# Altium schematic sheet Main.SchDoc
size A4; SheetNumber: 1; SheetTotal: 3
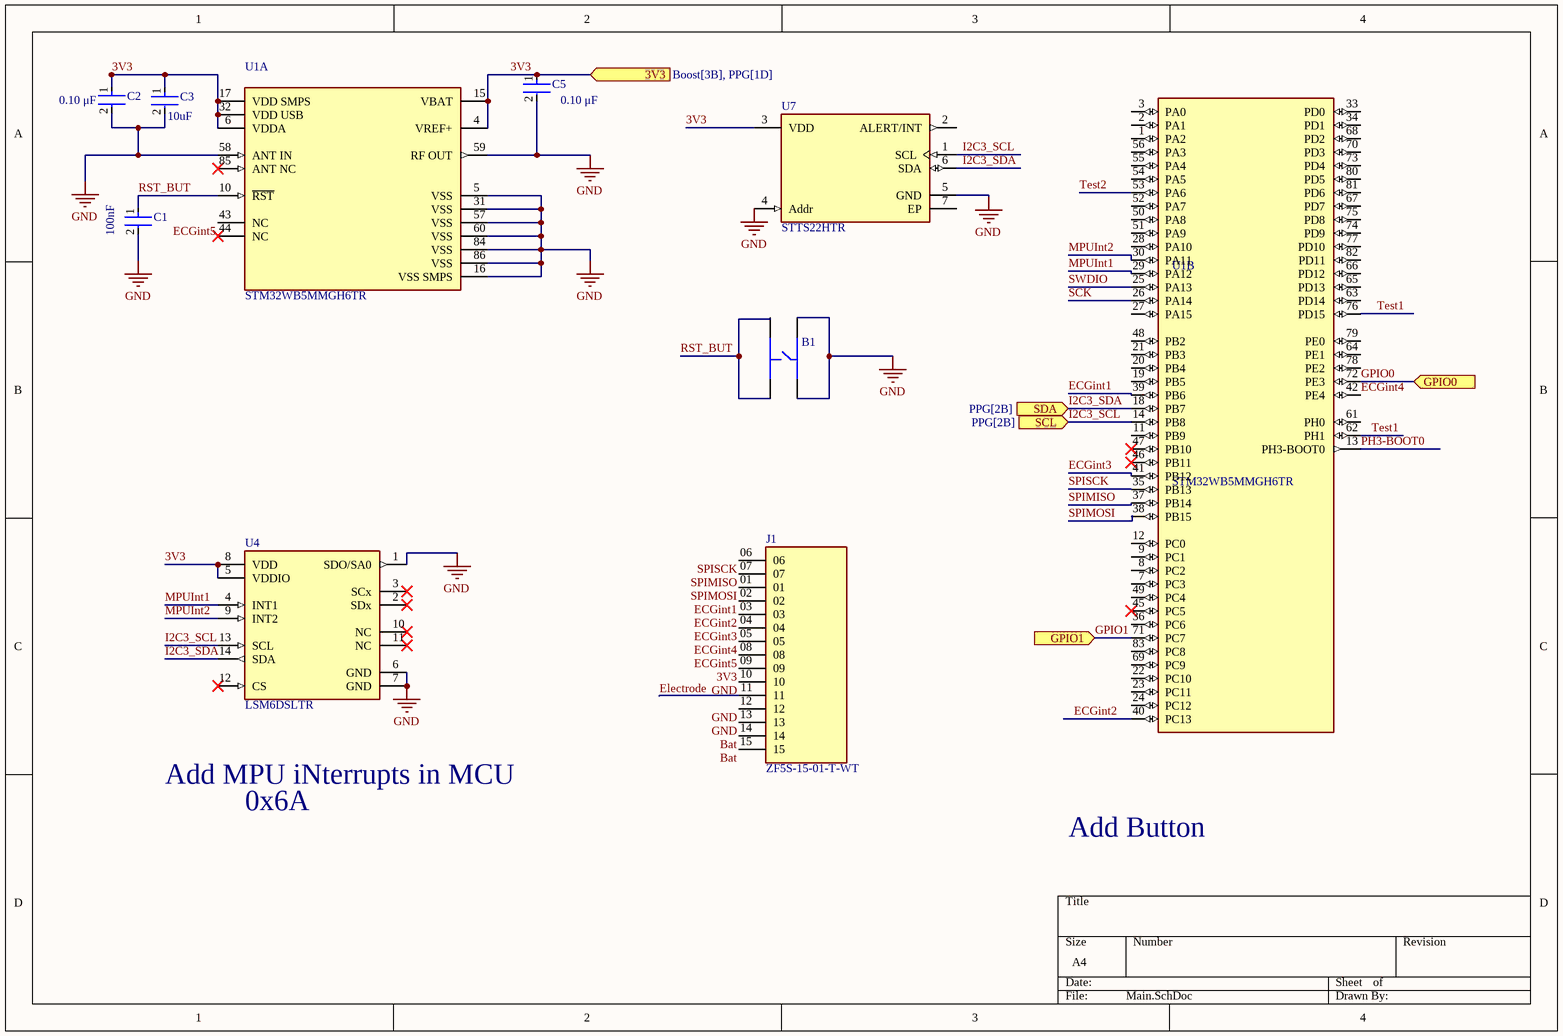
[diagram p0: Main.SchDoc]

## Parts
B1  TS3425PA  [TS3425PA]  (value not drawn)
C1  value 100nF  [FP-GRM155-0_05-MFG]  (hidden comment: GRM155R71C104KA88J)
C2  Capacitance: 0.10 μF  [FP-C0402-BB-MFG]  (hidden comment: C0402C104K3RACTU)
C3  Capacitance: 10uF  [FP-CL10-IPC_A]  (hidden comment: CL10A106MA8NRNC)
C5  Capacitance: 0.10 μF  [FP-C0402-BB-MFG]  (hidden comment: C0402C104K3RACTU)
J1  ZF5S-15-01-T-WT  [ZF5S-15-01-T-WT]
U1  STM32WB5MMGH6TR  [STM32WB5MMGH6TR]  (parts A,B of 2)
U4  LSM6DSLTR  [FP-LGA-14L-DM00249496-MFG]
U7  STTS22HTR  [FP-UDFN-6L-DM00423052-MFG]

## Ports
3V3 (in, see Boost[3B], PPG[1D]), GPIO0 (in, see PPG[2C]), GPIO1 (in, see PPG[2C]), SCL (in, see PPG[2B]), SDA (in, see PPG[2B])

## Nets
GND: B1.3 B1.4 C1.2 C2.2 C3.2 C5.2 J1.10 J1.12 J1.13 U1.5(VSS) U1.16(VSS_SMPS) U1.31(VSS) U1.57(VSS) U1.58(ANT_IN) U1.59(RF_OUT) U1.60(VSS) U1.84(VSS) U1.86(VSS) U4.1(SDO/SA0) U4.6(GND) U4.7(GND) U7.4(Addr) U7.5(GND)
3V3: C2.1 C3.1 C5.1 J1.09 U1.4(VREF+) U1.6(VDDA) U1.15(VBAT) U1.17(VDD_SMPS) U1.32(VDD_USB) U4.5(VDDIO) U4.8(VDD) U7.3(VDD) ; port 3V3
Bat: J1.14 J1.15
ECGint1: J1.02 U1.39(PB6)
ECGint2: J1.03 U1.40(PC13)
ECGint3: J1.04 U1.41(PB12)
ECGint4: J1.05 U1.42(PE4)
ECGint5: J1.08 U1.43(NC)
Electrode: J1.11
GPIO0: U1.72(PE3) ; port GPIO0
GPIO1: U1.71(PC7) ; port GPIO1
I2C3_SCL: U1.14(PB8) U4.13(SCL) U7.1(SCL) ; port SCL
I2C3_SDA: U1.18(PB7) U4.14(SDA) U7.6(SDA) ; port SDA
MPUInt1: U1.29(PA12) U4.4(INT1)
MPUInt2: U1.30(PA11) U4.9(INT2)
PH3-BOOT0: U1.13(PH3-BOOT0)
RST_BUT: B1.1 C1.1 U1.10(~{RST})
SCK: U1.26(PA14)
SPIMISO: J1.07 U1.37(PB14)
SPIMOSI: J1.01
SPISCK: J1.06 U1.35(PB13)
SWDIO: U1.25(PA13)
Test1: U1.62(PH1) U1.76(PD15)
Test2: U1.53(PA6)

Not connected (* = marked no-connect by the designer): B1 2; U1 1(PA2) 2(PA1) 3(PA0) 7(PC3) 8(PC2) 9(PC1) 11(PB9) 12(PC0) 19(PB5) 20(PB4) 21(PB3) 22(PC10) 23(PC11) 24(PC12) 27(PA15) 28(PA10) 33(PD0) 34(PD1) 36(PC6) 38(PB15) 44(NC)* 45(PC5)* 46(PB11)* 47(PB10)* 48(PB2) 49(PC4) 50(PA8) 51(PA9) 52(PA7) 54(PA5) 55(PA4) 56(PA3) 61(PH0) 63(PD14) 64(PE1) 65(PD13) 66(PD12) 67(PD7) 68(PD2) 69(PC9) 70(PD3) 73(PD4) 74(PD9) 75(PD8) 77(PD10) 78(PE2) 79(PE0) 80(PD5) 81(PD6) 82(PD11) 83(PC8) 85(ANT_NC)*; U4 2(SDx)* 3(SCx)* 10(NC)* 11(NC)* 12(CS)*; U7 2(ALERT/INT) 7(EP)

## Notes on the sheet
- Add MPU iNterrupts in MCU
- 0x6A
- Add Button

## Library data of the parts
C1 = CMP-2008-03928-2: NexarPartId: 9223238; Manufacturer Lifecycle Status: NRND; Manufacturer: Murata; Voltage: 16V; Tolerance: 10%; Dielectric: X7R; Material: Ceramic; Schedule B: 8532240020, 8532240020; Mount: Surface Mount; Case/Package: 0402; Case Code (Imperial): 0402; Min Operating Temperature: -55°C; Length: 1mm; Voltage Rating (DC): 16V; Depth: 500µm; Lead Free: Lead Free; Max Operating Temperature: 125°C; Case Code (Metric): 1005; Radiation Hardening: No; Height: 550µm; Voltage Rating: 16V; Packaging: Cut Tape; RoHS: Compliant; Width: 500µm; Number of Pins: 2; REACH SVHC: No SVHC; Termination: SMD/SMT; Thickness: 500µm; Capacitance: 100nF; Supplier: Digikey; Supplier Part Number: 490-6328-1-ND; Manufacturer Part Number: GRM155R71C104KA88J; Category: Ceramic Capacitors; Stock: 17752595; Pricing: 1=0.08, 10=0.009, 50=0.0072, 100=0.0056, 500=0.0052, 1000=0.0048, 2500=0.004 (USD); Mounting Technology: Surface Mount; Pins: 2NUMBER; Package Quantity: 1; Series: GRM; Construction: Flat; Reach SVHC Compliant: No; RoHS Compliant: Yes; ComponentLink1URL: https://datasheet.ciiva.com/6271/product-6271168.pdf?src-supplier=Digikey; ComponentLink1Description: https://datasheet.ciiva.com/6271/product-6271168.pdf?src-supplier=Digikey; ComponentLink2URL: https://datasheet.ciiva.com/6271/grm155r71c104ka88-01-6271231.pdf?src-supplier=Digikey; ComponentLink2Description: https://datasheet.ciiva.com/6271/grm155r71c104ka88-01-6271231.pdf?src-supplier=Digikey
C2 C5 = CMP-03020-012858-1: Cap Ceramic 0.1uF 25V X7R 10% Pad SMD 0402 125C T/R; Manufacturer: Kemet; Value: 0.10 μF; Temperature Coefficient: 15%; Tolerance: 0.1; Dielectric Material: 4241ConductorMaterial; Temperature: -55°C to +125°C; Automotive: No; Height: 0.55mm; Package: C0402-BB; Category: Cap; Temperature Range Low: -55°C; Manufacturer Part Number: C0402C104K3RACTU; Device Class L2: Capacitors; Temperature Characteristic: X7R; Lead Free: Yes; Material: Ceramic; Mouser Description: Cap Ceramic 0.1uF 25V X7R 10% Pad SMD 0402 125C T/R; Temperature Range High: +125°C; Digikey Description: Cap Ceramic 0.1uF 25V X7R 10% Pad SMD 0402 125C T/R; Ipc Land Pattern Name: CAPC10050X50; Voltage Rating: 25 V; ComponentLink2URL: https://content.kemet.com/datasheets/KEM_C1002_X7R_SMD.pdf; Device Class L3: Ceramic Capacitors; RoHS: TRUE; Device Class L1: Passive Components; Octopart: https://octopart.com/c0402c104k3ractu-kemet-71105629; ComponentLink2Description: Datasheet; Supplier: Digikey; Supplier Part Number: 399-14148-1-ND; Stock: 453452; Pricing: 1=0.16, 10=0.095, 100=0.0611, 1000=0.04279, 2500=0.03794, 5000=0.0349 (USD); Case/Package: 0402; Pins: 2NUMBER; Case Code (Metric): 1005; Case Code (Imperial): 0402; Min Operating Temperature: -55°C; Max Operating Temperature: 125°C; Dielectric: X7R; Packaging: Cut Tape; Voltage Rating (DC): 25V; Reach SVHC Compliant: No; RoHS Compliant: Yes; ComponentLink1URL: http://www.farnell.com/datasheets/2746129.pdf?src-supplier=Farnell; ComponentLink1Description: http://www.farnell.com/datasheets/2746129.pdf?src-supplier=Farnell; ComponentLink3URL: http://www.farnell.com/datasheets/2746129.pdf?src-supplier=Newark; ComponentLink3Description: http://www.farnell.com/datasheets/2746129.pdf?src-supplier=Newark; ComponentLink4URL: http://www.farnell.com/datasheets/2746129.pdf?src-supplier=Element14; ComponentLink4Description: http://www.farnell.com/datasheets/2746129.pdf?src-supplier=Element14; ComponentLink5URL: https://datasheet.octopart.com/C0402C104K3RACTU-Kemet-datasheet-62095741.pdf?src-supplier=Element14; ComponentLink5Description: https://datasheet.octopart.com/C0402C104K3RACTU-Kemet-datasheet-62095741.pdf?src-supplier=Element14; ComponentLink6URL: https://api.kemet.com/component-edge/download/datasheet/C0402C104K3RAC7867.pdf?src-supplier=Digikey; ComponentLink6Description: https://api.kemet.com/component-edge/download/datasheet/C0402C104K3RAC7867.pdf?src-supplier=Digikey; ComponentLink7URL: https://datasheet.octopart.com/C0402C104K3RACTU-KEMET-datasheet-176289272.pdf?src-supplier=Newark; ComponentLink7Description: https://datasheet.octopart.com/C0402C104K3RACTU-KEMET-datasheet-176289272.pdf?src-supplier=Newark; ComponentLink8URL: https://datasheet.octopart.com/C0402C104K3RACTU-KEMET-datasheet-157246124.pdf?src-supplier=Electro+Sonic; ComponentLink8Description: https://datasheet.octopart.com/C0402C104K3RACTU-KEMET-datasheet-157246124.pdf?src-supplier=Electro+Sonic
C3 = CMP-13271-004224-1: Cap Ceramic 10uF 25V X5R ±20% Pad SMD 0603 +85°C T/R; Width: 0.031inch; Voltage Rating: 25V; Length: 0.063inch; Case Code (Metric): 1608; Dielectric: X5R; Termination: Wraparound; Lead Free: Lead Free; Mount: Surface Mount; Package Quantity: 1; Case Code (Imperial): 0603; Thickness: 0.035inch; Packaging: Tape and Reel; Contact Plating: Tin; Min Operating Temperature: -55°C; Tolerance: 20%; Max Operating Temperature: 85°C; Case/Package: 0603
J1 = ZF5S-15-01-T-WT: FFC & FPC Connectors Zero Insertion Force Connector for FFC, 0.50 mm (.0197) Pitch; Manufacturer: Samtec; Actuator Material: Polymer,Liquid Crystal Polymer; Actuator Color: Black; Wire/Cable Type: Straight; Number of Positions: 15; Max Current Rating: 1.4A; Pitch: 0.5mm; Supplier: Digikey; Supplier Part Number: SAM10388-ND; Manufacturer Part Number: ZF5S-15-01-T-WT; RoHS: Yes; Category: FFC / FPC; Stock: 265; Pricing: 1=2.37, 50=1.93, 100=1.64, 500=1.46, 1000=1.2763 (USD); Mounting Technology: Surface Mount; Contact Material: Bronze; Contact Plating: Tin; Housing Color: Natural; Housing Material: Polymer; Min Operating Temperature: -55°C; Max Operating Temperature: 105°C; Packaging: Rail/Tube; Termination: Solder; Series: ZF5S; Number of Rows: 1; Number of Contacts: 15; Orientation: Right Angle; Length: 13.15mm; Depth: 5.66mm; Radiation Hardening: No; RoHS Compliant: Yes; ComponentLink1URL: http://www.farnell.com/datasheets/2607237.pdf?src-supplier=Farnell; ComponentLink1Description: http://www.farnell.com/datasheets/2607237.pdf?src-supplier=Farnell; ComponentLink2URL: http://components.arrow.com/part/dataview/51417210S9388675N1004?src-supplier=Arrow+Electronics; ComponentLink2Description: http://components.arrow.com/part/dataview/51417210S9388675N1004?src-supplier=Arrow+Electronics; ComponentLink3URL: http://www.farnell.com/datasheets/2607237.pdf?src-supplier=Newark; ComponentLink3Description: http://www.farnell.com/datasheets/2607237.pdf?src-supplier=Newark; ComponentLink4URL: http://www.samtec.com/documents/webfiles/pdf/zf5s.pdf?src-supplier=Avnet; ComponentLink4Description: http://www.samtec.com/documents/webfiles/pdf/zf5s.pdf?src-supplier=Avnet; ComponentLink5URL: http://suddendocs.samtec.com/prints/zf5s-xx-xx-x-wt-x-xx-mkt.pdf?src-supplier=Digikey; ComponentLink5Description: http://suddendocs.samtec.com/prints/zf5s-xx-xx-x-wt-x-xx-mkt.pdf?src-supplier=Digikey; Supplier 1: Digikey; Supplier Part Number 1: SAM10388-ND
U1 = STM32WB5MMGH6TR: RISC Microcontroller, 32-Bit, FLASH, CORTEX-M4F CPU, 180MHz, CMOS, PBGA216; Manufacturer: STMicroelectronics; Interface: 39,40,224,1519,1532,1533,4268Interface; Data Rate: 2Mbps; Clock Frequency: 2.4GHz; Max Supply Voltage: 3.6V; Min Supply Voltage: 1.71V; Number of GPIO: 68NUMBER; Supplier: Digikey; Supplier Part Number: 497-STM32WB5MMGH6CT-ND; Manufacturer Part Number: STM32WB5MMGH6TR; RoHS: No; Category: Microcontrollers; Stock: 5514; Pricing: 1=12.14, 10=9.532, 25=8.8804, 100=8.1641, 250=7.8228, 500=7.61702 (USD); Min Operating Temperature: -40°C; Max Operating Temperature: 85°C; Height: 1.428mm; Supplier 1: Digikey; Supplier Part Number 1: 497-STM32WB5MMGH6CT-ND
U4 = CMP-2000-07467-2: IMU ACCEL/GYRO I2C/SPI 14LGA; Manufacturer: STMicroelectronics; Resolution: 16bits; Max Supply Voltage: 3.6V; Sensor Type: Temperature,Accelerometer,Gyroscope; Sensor Output: I2C,SPI; Gyro Range: 125/250/500/1000/2000°/s; Accel Range: 2/4/8/16g; Operating Supply Current: 0.29-0.65mA; Min Supply Voltage: 1.62V; Package: LGA-14L-DM00249496; Temperature Range High: +85°C; Automotive: No; Footprint Url: https://www.st.com/resource/en/technical_note/cd00134799.pdf; Height: 0.86mm; Device Class L1: Sensors; Octopart: https://octopart.com/lsm6dsltr-stmicroelectronics-66358193; Device Class L2: Motion Sensors; Lead Free: Yes; Category: IC; Device Class L3: Inertial Measurement Units (IMUs); ComponentLink2Description: Datasheet; RoHS: TRUE; ComponentLink2URL: https://www.st.com/resource/en/datasheet/lsm6dsl.pdf; Temperature Range Low: -40°C; Manufacturer Part Number: LSM6DSLTR; Mouser Description: iNEMO inertial module: always-on 3D accelerometer and 3D gyroscope; Digikey Description: IMU ACCEL/GYRO I2C/SPI 14LGA; Temperature: -40°C to +85°C
U7 = CMP-12184-000002-1: LOW-VOLTAGE, ULTRA-LOW-POWER, 0.; Manufacturer: STMicroelectronics; Max Supply Voltage: 3.6V; Sensor Output: I2C,SMBus; Min Supply Voltage: 1.5V; Resolution: 16bits; Standoff Height: 0mm; Operating Supply Current: 1.75-120uA; Octopart: https://octopart.com/stts22htr-stmicroelectronics-103417944; Temperature: -40°C to +125°C; Interface: I2C,SMBus; ComponentLink2Description: Datasheet; Device Class L3: unset; Lead Free: Yes; Temperature Range Low: -40°C; ComponentLink2URL: https://www.st.com/resource/en/datasheet/stts22h.pdf; Temperature Range High: +125°C; RoHS: TRUE; Automotive: No; Device Class L1: Sensors; Category: IC; Manufacturer Part Number: STTS22HTR; Package: UDFN-6L-DM00423052; Device Class L2: Temperature and Humidity Sensors; Mouser Description: Low-voltage, ultra-low-power, 0.5 ï¿½C accuracy Iï¿½C/SMBus 3.0 temperature sensor; Digikey Description: LOW-VOLTAGE, ULTRA-LOW-POWER, 0.; Height: 0.55mm